# Altium schematic sheet Programmer_Sheet.SchDoc
size A
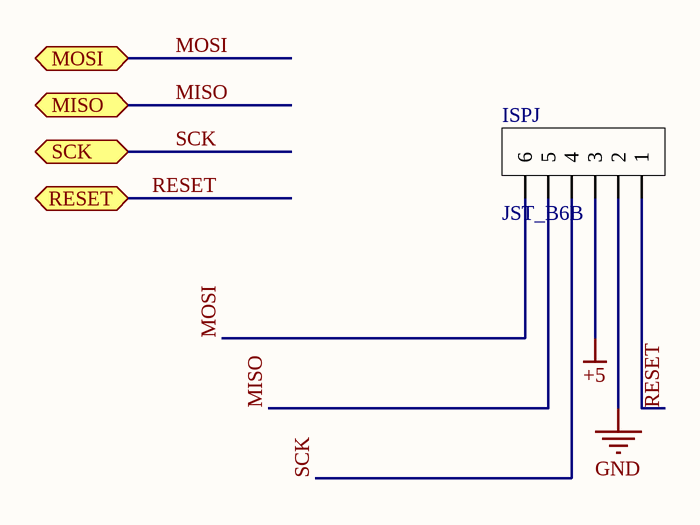
[diagram p0: Programmer_Sheet.SchDoc]

## Parts
ISPJ  JST_B6B  [JST_B6B]

## Ports
MISO (bidir), MOSI (bidir), RESET (bidir), SCK (bidir)

## Nets
+5: ISPJ.3
GND: ISPJ.2
MISO: ISPJ.5 ; port MISO
MOSI: ISPJ.6 ; port MOSI
RESET: ISPJ.1 ; port RESET
SCK: ISPJ.4 ; port SCK